# EAGLE schematic ddrive-esp-deadrail-1-1 (EAGLE 7.2.0)
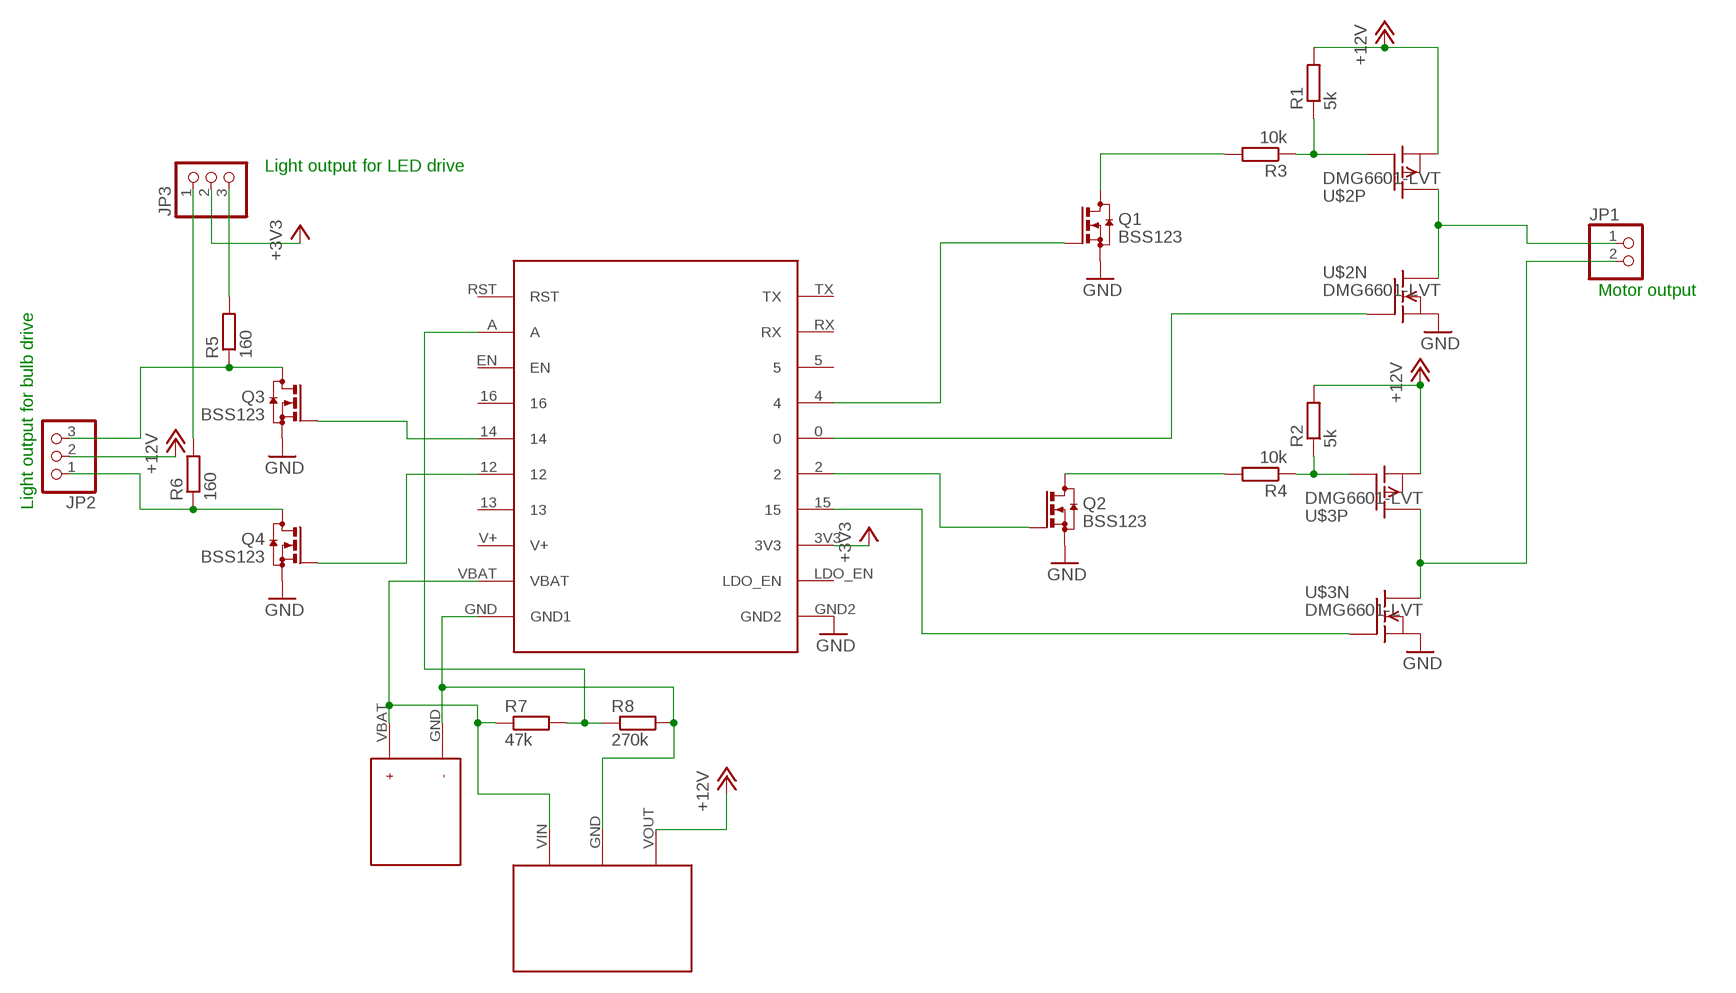
[diagram p0: schematic, sheet 1]

## Parts
JP1  PINHD-1X2  [1X02]
JP2  PINHD-1X3  [1X03]
JP3  PINHD-1X3  [1X03]
Q1  BSS123  [SOT23]
Q2  BSS123  [SOT23]
Q3  BSS123  [SOT23]
Q4  BSS123  [SOT23]
R1  5k  R-EU_R0805  [R0805]
R2  5k  R-EU_R0805  [R0805]
R3  10k  R-EU_R0805  [R0805]
R4  10k  R-EU_R0805  [R0805]
R5  160  R-EU_R0805  [R0805]
R6  160  R-EU_R0805  [R0805]
R7  47k  R-EU_R0805  [R0805]
R8  270k  R-EU_R0805  [R0805]
U$1  ESP12-HUZZAH  [ESP12-HUZZAH]
U$2  DMG6601-LVT  [TSOT-26]
U$3  DMG6601-LVT  [TSOT-26]
U$4  JST-PINHD  [JST-PINHDR]
U$5  POLOLU-VREG12  [POLOLU-REGULATOR]

## Nets
+3V3: JP3.2 U$1.3V3
+12V: JP2.2 R1.2 R2.2 U$2.2(P:S) U$3.2(P:S) U$5.VOUT
GND: Q1.2(S) Q2.2(S) Q3.2(S) Q4.2(S) U$1.GND2 U$2.5(N:S) U$3.5(N:S)
N$1: JP1.1 U$2.4(P:D) U$2.6(N:D)
N$2: R1.1 R3.1 U$2.3(P:G)
N$3: Q2.3(D) R4.2
N$4: R2.1 R4.1 U$3.3(P:G)
N$5: Q1.1(G) U$1.4
N$6: Q1.3(D) R3.2
N$7: JP1.2 U$3.4(P:D) U$3.6(N:D)
N$8: U$1.0 U$2.1(N:G)
N$9: Q2.1(G) U$1.2
N$10: U$1.15 U$3.1(N:G)
N$11: Q3.1(G) U$1.14
N$12: Q4.1(G) U$1.12
N$13: JP2.3 Q3.3(D) R5.1
N$14: JP2.1 Q4.3(D) R6.1
N$15: JP3.3 R5.2
N$16: JP3.1 R6.2
N$17: R8.2 U$1.GND(GND1) U$4.GND U$5.GND
N$18: R7.1 U$1.VBAT U$4.VBAT U$5.VIN
N$19: R7.2 R8.1 U$1.A
Unconnected: U$1.5 U$1.13 U$1.16 U$1.EN U$1.LDO_EN U$1.RST U$1.RX U$1.TX

## Notes on the sheet
- Light output for LED drive
- Motor output
- Light output for bulb drive

## Power pins joined to a net without a drawn wire
V+: U$1.V+

## Library data of the parts
JP1 = pinhead:PINHD-1X2: PIN HEADER
JP2 JP3 = pinhead:PINHD-1X3: PIN HEADER
Q1-Q4 = transistor-small-signal:BSS123: N-CHANNEL MOS FET
R1-R8 = rcl:R-EU_: RESISTOR, European symbol
U$1 = trainlib:ESP12-HUZZAH
U$2 U$3 = trainlib:DMG6601-LVT: Dual N+P-channel MOSFET. Package: TSOT-26 Vmax=30V N-channel: 55mOhm, 3.8A Imax P-channel: 110mOhm, 2.5A Imax
U$4 = trainlib:JST-PINHD
U$5 = trainlib:POLOLU-VREG12